# EAGLE schematic Circuito_elétrico_Atividades05 (EAGLE 9.6.2)
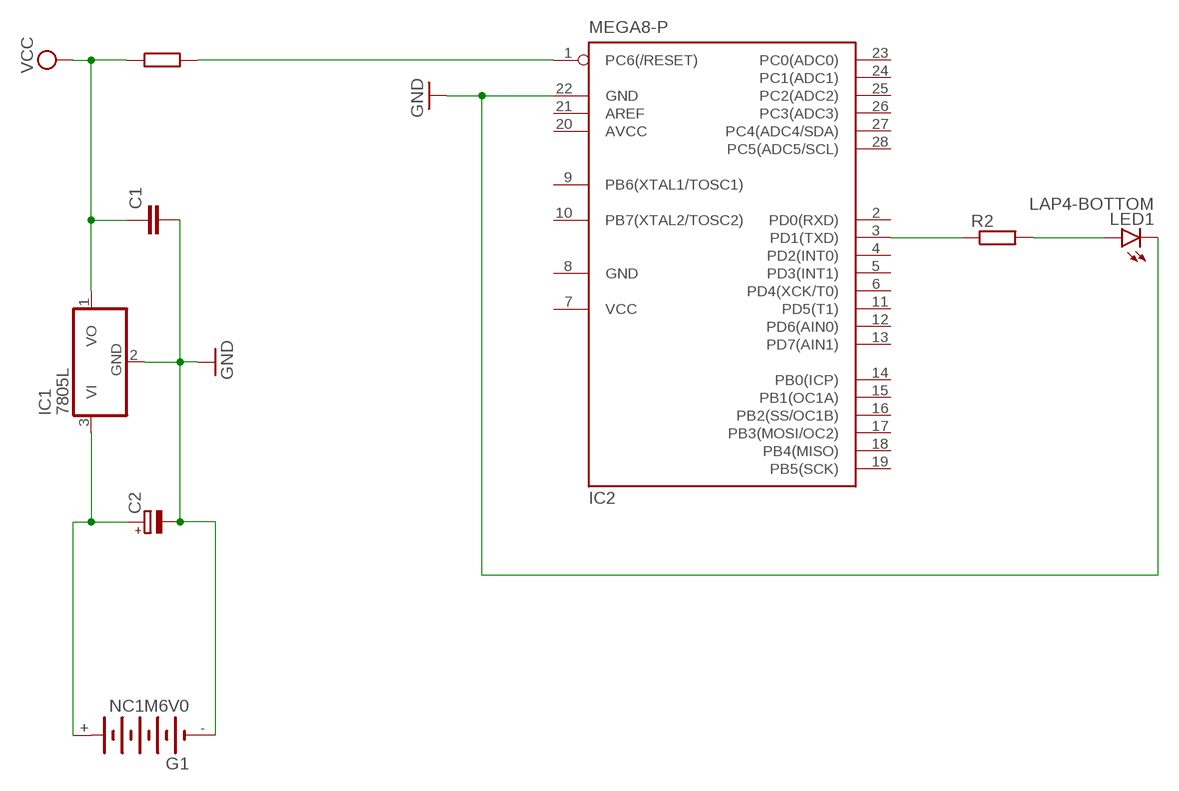
[diagram p0: schematic, sheet 1]

## Parts
C1  C-EU075-032X103  [C075-032X103]
C2  CPOL-EUE5-10.5  [E5-10,5]
G1  NC1M6V0  [NC1M]
IC1  7805L  [TO92]
IC2  MEGA8-P  [DIL28-3]
LED1  LAP4-BOTTOM  [P47F-BOTTOM]
R2  R-EU_0207/5V  [0207/5V]

## Nets
GND: C1.2 C2.- G1.- IC1.2(GND) IC2.22(GND) LED1.C
N$1: IC2.3(PD1(TXD)) R2.1
N$2: C2.+ G1.+ IC1.3(VI)
N$3: IC2.1(PC6(/RESET))
N$4: LED1.A R2.2
VCC: C1.1 IC1.1(VO)
Unconnected: IC2.2(PD0(RXD)) IC2.4(PD2(INT0)) IC2.5(PD3(INT1)) IC2.6(PD4(XCK/T0)) IC2.9(PB6(XTAL1/TOSC1)) IC2.10(PB7(XTAL2/TOSC2)) IC2.11(PD5(T1)) IC2.12(PD6(AIN0)) IC2.13(PD7(AIN1)) IC2.14(PB0(ICP)) IC2.15(PB1(OC1A)) IC2.16(PB2(SS/OC1B)) IC2.17(PB3(MOSI/OC2)) IC2.18(PB4(MISO)) IC2.19(PB5(SCK)) IC2.21(AREF) IC2.23(PC0(ADC0)) IC2.24(PC1(ADC1)) IC2.25(PC2(ADC2)) IC2.26(PC3(ADC3)) IC2.27(PC4(ADC4/SDA)) IC2.28(PC5(ADC5/SCL))

## Power pins joined to a net without a drawn wire
AVCC: IC2.20(AVCC)
GND: IC2.8(GND)
VCC: IC2.7(VCC)

## Library data of the parts
C1 = rcl:C-EU: CAPACITOR, European symbol; SPICEPREFIX: C
C2 = rcl:CPOL-EU: POLARIZED CAPACITOR, European symbol; SPICEPREFIX: C
G1 = battery:NC1M6V0: NC ACCU Sonnenschein Mini-Memo NC-M 6.0V R5
IC1 = linear:78*: Positive VOLTAGE REGULATOR Source: http://cache.national.com/ds/LM/LM78L05.pdf http://www.fairchildsemi.com/ds/LM/LM7805.pdf
IC2 = atmel:MEGA8-P: MICROCONTROLLER 8 Kbytes FLASH, 1 kbytes SRAM, 512 bytes EEPROM, USART, 4-channel 10 bit ADC, 2-channel 8 bit ADC Pin compatible with Atmega48, ATMega88, ATMega168 Source: avr.lbr; OC_FARNELL: unknown; OC_NEWARK: unknown
LED1 = led:*P4: PointLED® Enhanced Thinfilm LED TOP & BOTTOM mount LS P47F, LR P47F, LA P47F, LY P47F, LT P4SG, LB P4SG, LW P4SG Source: http://catalog.osram-os.com .. LA_LR_LS_LY_P47F_Pb_free.pdf
R2 = rcl:R-EU_: RESISTOR, European symbol; SPICEPREFIX: R